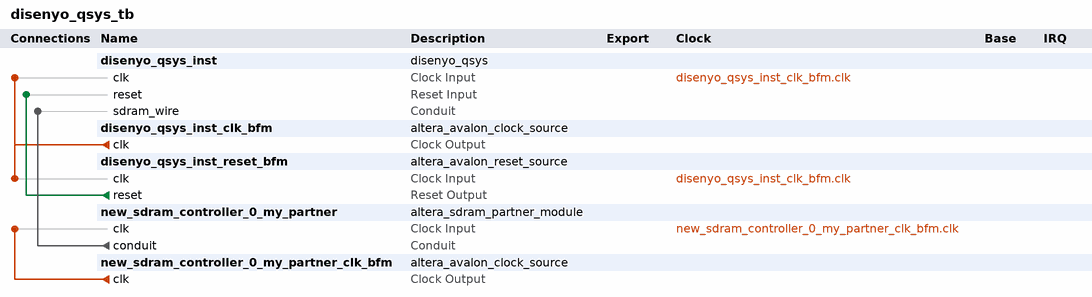
[diagram p0: system contents]
# Platform Designer (Qsys) system disenyo_qsys_tb, Cyclone IV E EP4CE115F29C7
# Parameters at their usual value, and those the tool derives, are not listed.
package require -exact qsys 19.1
create_system disenyo_qsys_tb
set_project_property DEVICE_FAMILY {Cyclone IV E}
set_project_property DEVICE EP4CE115F29C7

add_instance disenyo_qsys_inst disenyo_qsys 1.0

add_instance disenyo_qsys_inst_clk_bfm altera_avalon_clock_source 19.1

add_instance disenyo_qsys_inst_reset_bfm altera_avalon_reset_source 19.1
set_instance_parameter_value disenyo_qsys_inst_reset_bfm ASSERT_HIGH_RESET 0
set_instance_parameter_value disenyo_qsys_inst_reset_bfm INITIAL_RESET_CYCLES 50

add_instance new_sdram_controller_0_my_partner altera_sdram_partner_module 11.0
set_instance_parameter_value new_sdram_controller_0_my_partner CONTR_NAME disenyo_qsys_new_sdram_controller_0
set_instance_parameter_value new_sdram_controller_0_my_partner SDRAM_COL_WIDTH 10
set_instance_parameter_value new_sdram_controller_0_my_partner SDRAM_DATA_WIDTH 32
set_instance_parameter_value new_sdram_controller_0_my_partner SDRAM_ROW_WIDTH 13

add_instance new_sdram_controller_0_my_partner_clk_bfm altera_avalon_clock_source 19.1

# connections
add_connection disenyo_qsys_inst_clk_bfm.clk disenyo_qsys_inst.clk clock
add_connection disenyo_qsys_inst_clk_bfm.clk disenyo_qsys_inst_reset_bfm.clk clock
add_connection new_sdram_controller_0_my_partner_clk_bfm.clk new_sdram_controller_0_my_partner.clk clock
add_connection disenyo_qsys_inst_reset_bfm.reset disenyo_qsys_inst.reset reset
add_connection new_sdram_controller_0_my_partner.conduit disenyo_qsys_inst.sdram_wire conduit

set_interconnect_requirement {$system} qsys_mm.clockCrossingAdapter HANDSHAKE
set_interconnect_requirement {$system} qsys_mm.enableEccProtection FALSE
set_interconnect_requirement {$system} qsys_mm.insertDefaultSlave FALSE
set_interconnect_requirement {$system} qsys_mm.maxAdditionalLatency 1

save_system disenyo_qsys_tb.qsys
